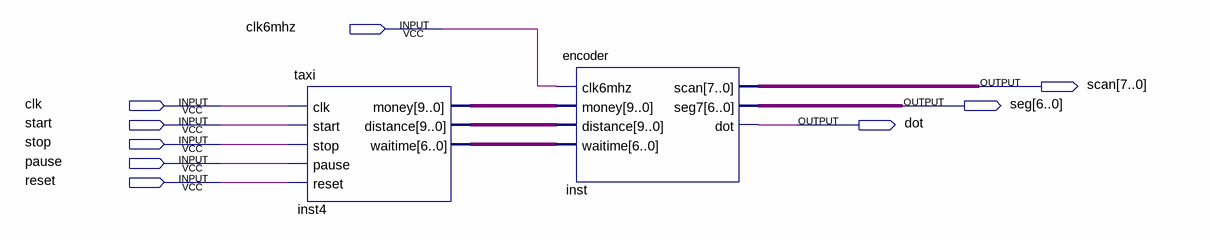
[diagram p0: schematic sheet]
// Quartus schematic taxi_encoder.bdf as structural Verilog: 2 symbols, 9 pins
module taxi_encoder (
  input  clk6mhz,
  input  clk,
  input  start,
  input  stop,
  input  pause,
  input  reset,
  output [7:0] scan,
  output [6:0] seg,
  output dot
);

  wire [6:0] inst4_waitime;
  wire [9:0] inst4_distance, inst4_money;

  taxi inst4 (
    .clk(clk), .start(start), .stop(stop), .pause(pause), .reset(reset), .money(inst4_money),
    .distance(inst4_distance), .waitime(inst4_waitime));
  encoder inst (
    .clk6mhz(clk6mhz), .money(inst4_money), .distance(inst4_distance), .waitime(inst4_waitime), .scan(scan),
    .seg7(seg), .dot(dot));
endmodule
